# EAGLE design SpeechSynthesisBoard (EAGLE 7.5.0)
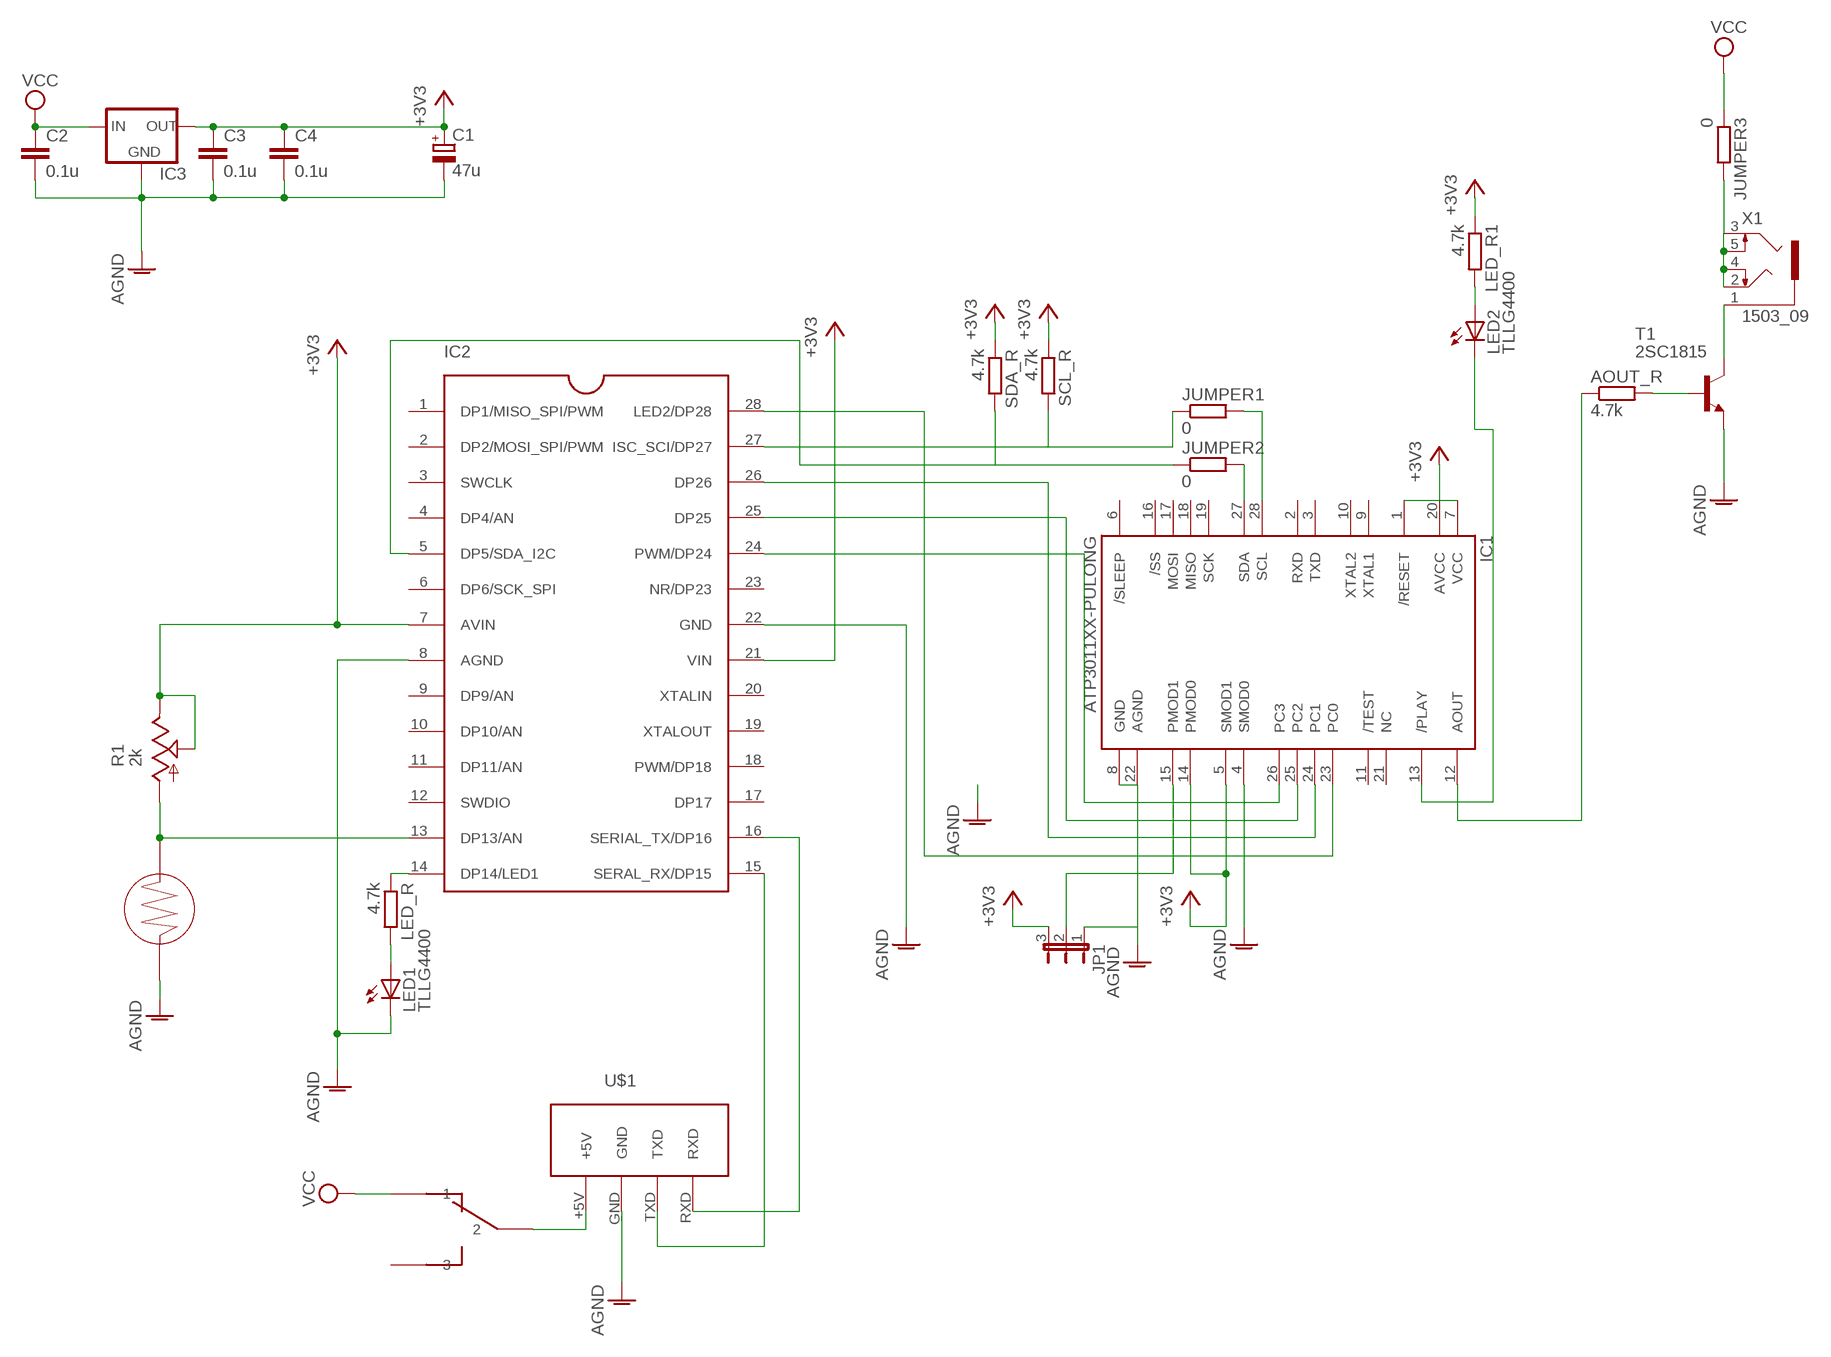
[diagram p0: schematic, sheet 1]

## Parts
AOUT_R  4.7k  R-EU_0204/7  [0204/7]
B-12JB1  B-12JV  [B-12JV]
C1  47u  CPOL-EUE2.5-5  [E2,5-5]
C2  0.1u  C-EU025-024X044  [C025-024X044]
C3  0.1u  C-EU025-024X044  [C025-024X044]
C4  0.1u  C-EU025-024X044  [C025-024X044]
CDS_5MM1  CDS_5MM  [CDS_5MM]
IC1  ATP3011XX-PULONG  [DIL28-3]
IC2  LPC1114FN28  [DIP28]
IC3  78XXL  [78XXL]
JP1  JP2E  [JP2]
JUMPER1  0  R-EU_0309/12  [0309/12]
JUMPER2  0  R-EU_0309/12  [0309/12]
JUMPER3  0  R-EU_0309/12  [0309/12]
LED1  TLLG4400  [LED3MM]
LED2  TLLG4400  [LED3MM]
LED_R  4.7k  R-EU_0204/7  [0204/7]
LED_R1  4.7k  R-EU_0204/7  [0204/7]
R1  2k  TRIM_US-CA6V  [CA6V]
SCL_R  4.7k  R-EU_0204/7  [0204/7]
SDA_R  4.7k  R-EU_0204/7  [0204/7]
T1  2SC1815  [TO92-ECB]
U$1  USB2UART  [USB2UART]
X1  1503_09  [1503_09]

## Nets
+3V3: C1.+ C3.1 C4.1 IC1.1(/RESET) IC1.5(SMOD1) IC1.7(VCC) IC1.14(PMOD0) IC1.20(AVCC) IC2.7(AVIN) IC2.21(VIN) IC3.OUT JP1.3 LED_R1.1 R1.E R1.S SCL_R.1 SDA_R.1
AGND: C1.- C2.2 C3.2 C4.2 CDS_5MM1.P$2 IC1.4(SMOD0) IC1.8(GND) IC1.22(AGND) IC2.8(AGND) IC2.22(GND) IC3.GND JP1.1 LED1.K(C) T1.E U$1.GND
N$1: LED1.A LED_R.2
N$2: IC1.13(/PLAY) LED2.K(C)
N$3: IC2.14(DP14/LED1) LED_R.1
N$4: LED2.A LED_R1.2
N$5: AOUT_R.1 IC1.12(AOUT)
N$6: AOUT_R.2 T1.B
N$7: IC2.27(ISC_SCI/DP27) JUMPER1.1 SCL_R.2
N$8: IC2.5(DP5/SDA_I2C) JUMPER2.1 SDA_R.2
N$9: T1.C X1.1
N$10: IC1.26(PC3) IC2.24(PWM/DP24)
N$11: IC1.25(PC2) IC2.25(DP25)
N$12: IC1.23(PC0) IC2.28(LED2/DP28)
N$13: IC1.24(PC1) IC2.26(DP26)
N$14: IC2.16(SERIAL_TX/DP16) U$1.RXD
N$15: IC1.15(PMOD1) JP1.2
N$16: IC2.15(SERAL_RX/DP15) U$1.TXD
N$17: B-12JB1.2 U$1.+5V
N$18: IC1.27(SDA) JUMPER2.2
N$19: CDS_5MM1.P$1 IC2.13(DP13/AN) R1.A
N$20: IC1.28(SCL) JUMPER1.2
N$21: JUMPER3.2 X1.2 X1.3 X1.4 X1.5
VCC: B-12JB1.1 C2.1 IC3.IN JUMPER3.1
Unconnected: B-12JB1.3 IC1.2(RXD) IC1.3(TXD) IC1.6(/SLEEP) IC1.9(XTAL1) IC1.10(XTAL2) IC1.11(/TEST) IC1.16(/SS) IC1.17(MOSI) IC1.18(MISO) IC1.19(SCK) IC1.21(NC) IC2.1(DP1/MISO_SPI/PWM) IC2.2(DP2/MOSI_SPI/PWM) IC2.3(SWCLK) IC2.4(DP4/AN) IC2.6(DP6/SCK_SPI) IC2.9(DP9/AN) IC2.10(DP10/AN) IC2.11(DP11/AN) IC2.12(SWDIO) IC2.17(DP17) IC2.18(PWM/DP18) IC2.19(XTALOUT) IC2.20(XTALIN) IC2.23(NR/DP23)

## Library data of the parts
AOUT_R JUMPER1-JUMPER3 LED_R LED_R1 SCL_R SDA_R = rcl:R-EU_: RESISTOR, European symbol
B-12JB1 = toggleswitchB-12JV:B-12JV
C1 = rcl:CPOL-EU: POLARIZED CAPACITOR, European symbol
C2-C4 = rcl:C-EU: CAPACITOR, European symbol
CDS_5MM1 = CdS_5mm:CDS_5MM
IC1 = aquest:ATP3011XX-PU: DIP 28 pin package
IC2 = lpc1114fn28:LPC1114FN28
IC3 = v-reg:78XXL: VOLTAGE REGULATOR
JP1 = jumper:JP2E: JUMPER
LED1 LED2 = led:TLLG4400: Low Current (2mA) LED 3 mm Tinted Diffused Package color GREEN Source: Data sheet <http://www.farnell.com/datasheets/391098.pdf>; MF: VISHAY SEMICONDUCTOR; OC_FARNELL: 1612435
R1 = pot:TRIM_US-: POTENTIOMETER
T1 = transistor:2SC1815: NPN EPITAXIAL TRANSISTOR Source: TOSHIBA .. 2SC1815 1.pdf
U$1 = USBtoUART_module(M-08461):USB2UART
X1 = con-lumberg:1503_09: Jack connectors according to JISC 6560, 3.5 mm Klinkeneinbaukupplung nach JISC 6560, 3,5 mm, 3-polig/ stereo, abgewinkelte Ausführung, mit 2 Öffnern und Lötaugen, für Leiterplatten Rückseitenmontage Source: http://www.lumberg.com/Produkte/PDFs/1503_09.pdf; OC_FARNELL: 1243244; OC_NEWARK: unknown

## Board
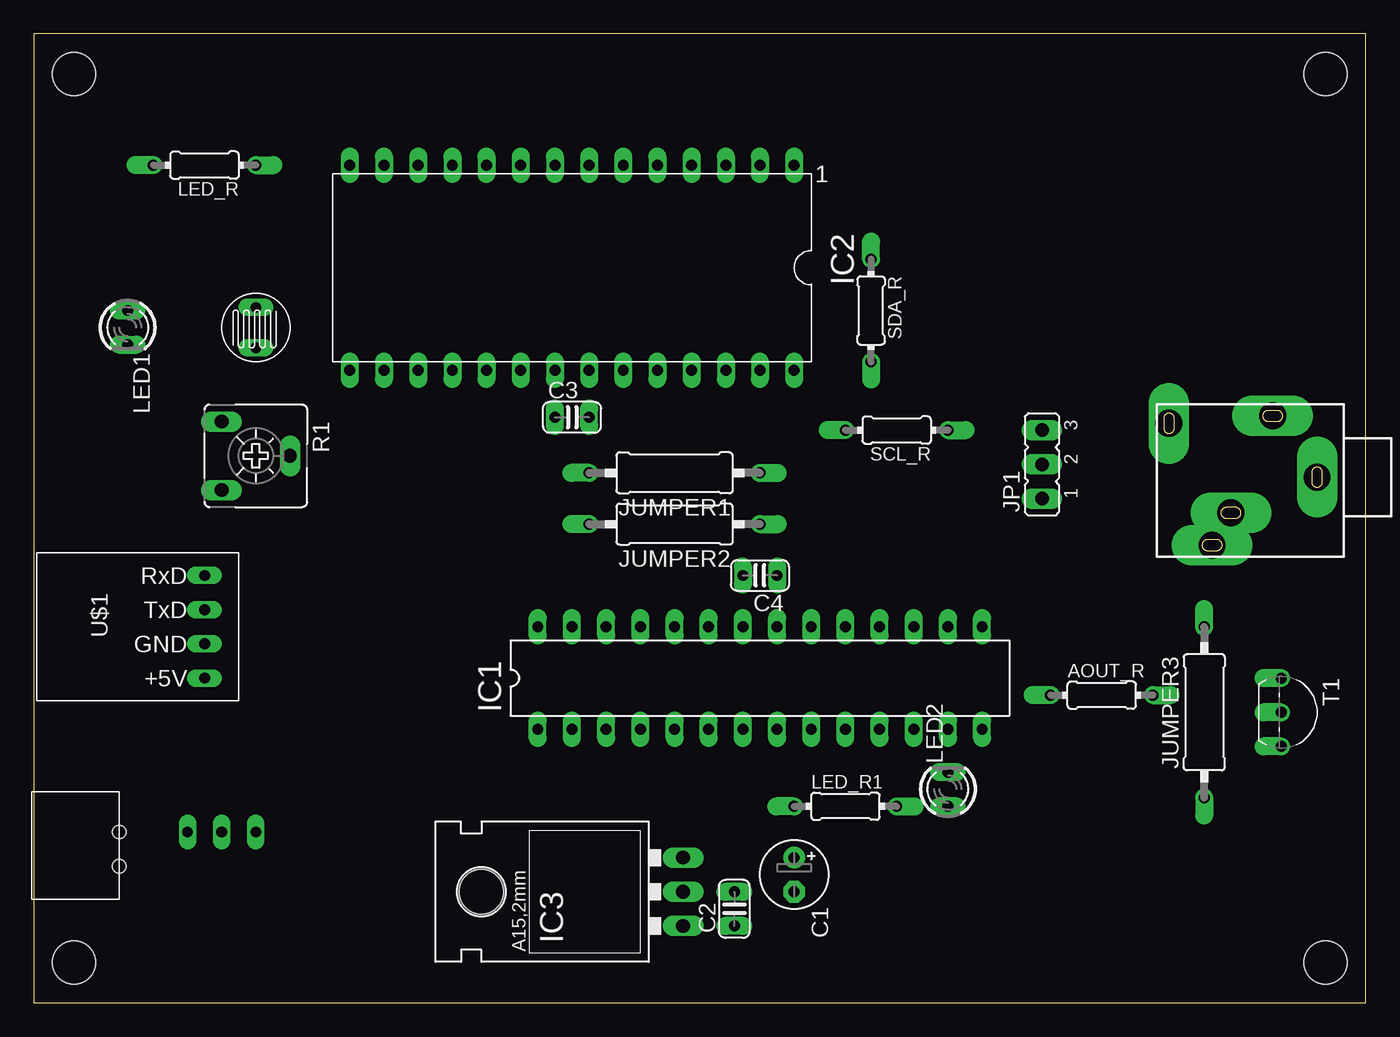
[diagram p1: board, top side]
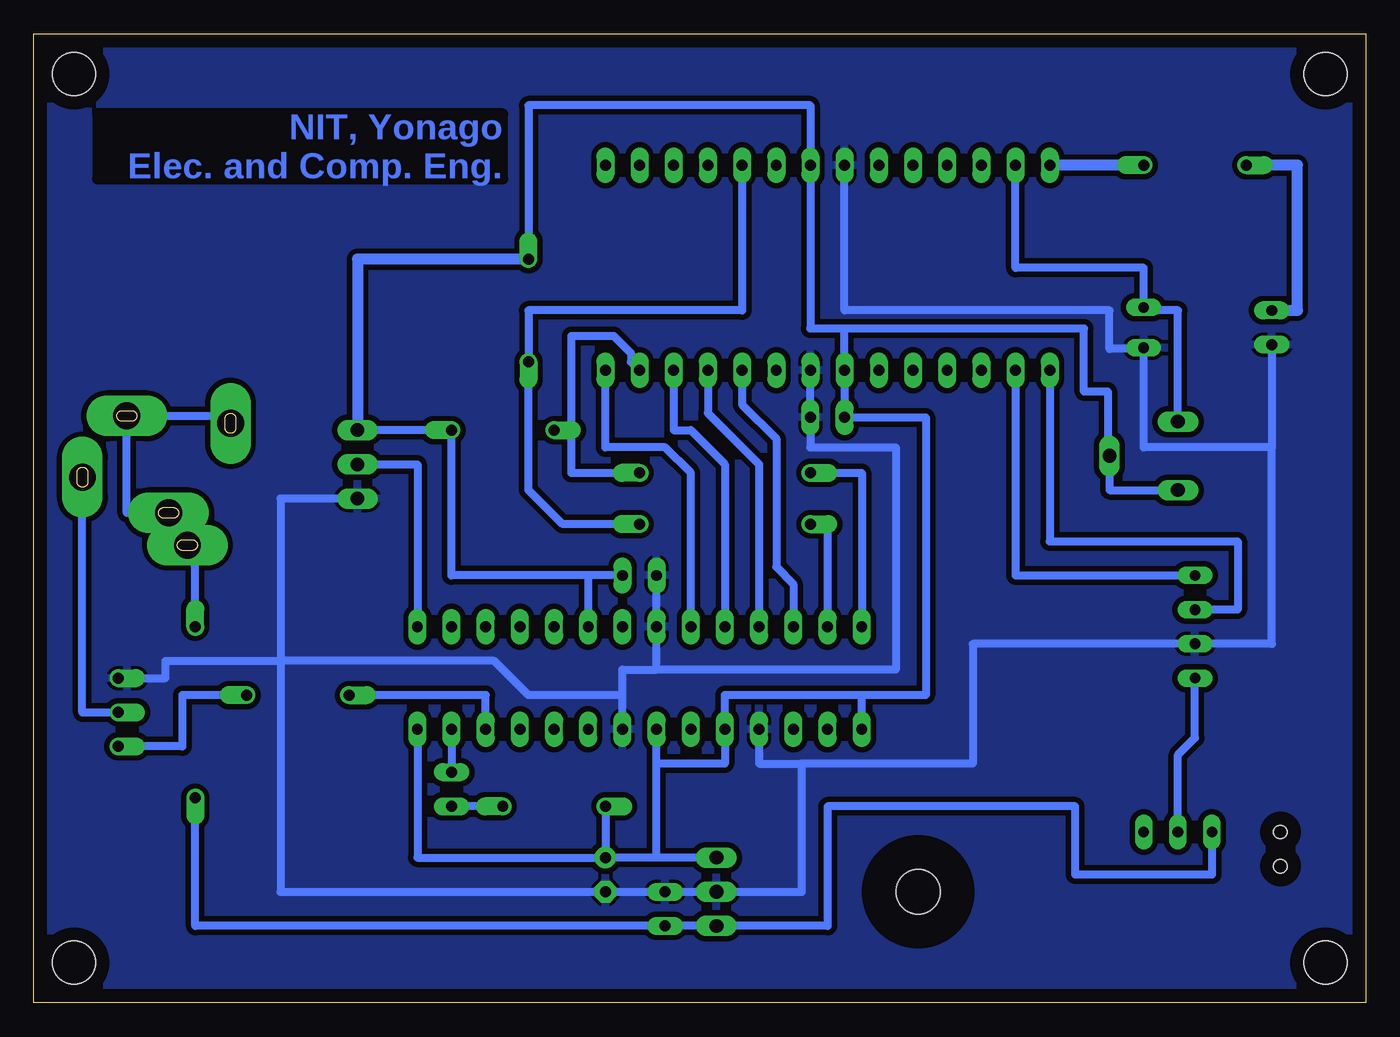
[diagram p2: board, bottom side, seen from below]

Size 99 x 72 mm. Coordinates in mm from the lower left corner, seen from the top.
Outline: 0,0 99,0 99,72 0,72 0,0
Copper layers (1*16): Top 0.035mm / dielectric 1.5mm / Bottom 0.035mm
Design rules "default *": minimum track width 24mil, minimum drill 24mil, track to track 0.4mm, track to pad 0.4mm, pad to pad 0.4mm, via to via 0.4mm, smd to smd 0.5mm, copper to edge 1mm, drill to drill 0.5mm, minimum pad ring 10mil, minimum via ring 8mil, stop-mask expansion 4mil, vias tented up to drill 0mil, thermal gap 10mil
Holes 3.2 mm at 3,3 3,69 96,69 96,3

### Footprints (pad centres in the part's own frame; a part is rotated, then mirrored left to right if it is on the bottom)
0204/7 = drill 0.813 offset: 1 -3.81,0; 2 3.81,0
B-12JV = drill 0.8 long: 1 0,5.08; 2 0,7.62; 3 0,10.16 | hole 1: 0,0; 2.54,0
E2,5-5 = drill 0.813 pad 1.6: + -1.27,0 | drill 0.813 pad 1.6 octagon: - 1.27,0
C025-024X044 = drill 0.813 long: 1 -1.27,0; 2 1.27,0
CDS_5MM = drill 0.8 long: P$1 1.5,0; P$2 -1.5,0
DIL28-3 = drill 0.813 long: 1 -16.51,-3.81; 2 -13.97,-3.81; 3 -11.43,-3.81; 4 -8.89,-3.81; 5 -6.35,-3.81; 6 -3.81,-3.81; 7 -1.27,-3.81; 8 1.27,-3.81; 9 3.81,-3.81; 10 6.35,-3.81; 11 8.89,-3.81; 12 11.43,-3.81; 13 13.97,-3.81; 14 16.51,-3.81; 15 16.51,3.81; 16 13.97,3.81; 17 11.43,3.81; 18 8.89,3.81; 19 6.35,3.81; 20 3.81,3.81; 21 1.27,3.81; 22 -1.27,3.81; 23 -3.81,3.81; 24 -6.35,3.81; 25 -8.89,3.81; 26 -11.43,3.81; 27 -13.97,3.81; 28 -16.51,3.81
DIP28 = drill 0.813 long: 1 -16.51,-7.62; 2 -13.97,-7.62; 3 -11.43,-7.62; 4 -8.89,-7.62; 5 -6.35,-7.62; 6 -3.81,-7.62; 7 -1.27,-7.62; 8 1.27,-7.62; 9 3.81,-7.62; 10 6.35,-7.62; 11 8.89,-7.62; 12 11.43,-7.62; 13 13.97,-7.62; 14 16.51,-7.62; 15 16.51,7.62; 16 13.97,7.62; 17 11.43,7.62; 18 8.89,7.62; 19 6.35,7.62; 20 3.81,7.62; 21 1.27,7.62; 22 -1.27,7.62; 23 -3.81,7.62; 24 -6.35,7.62; 25 -8.89,7.62; 26 -11.43,7.62; 27 -13.97,7.62; 28 -16.51,7.62
78XXL = drill 1.016 long: GND 0,-3.81; IN -2.54,-3.81; OUT 2.54,-3.81 | hole 3.302: 0,11.176
JP2 = drill 1 long: 1 -2.54,0; 2 0,0; 3 2.54,0
0309/12 = drill 0.813 offset: 1 -6.35,0; 2 6.35,0
LED3MM = drill 0.813 long: A -1.27,0; K 1.27,0
CA6V = drill 1.016 long: A -2.54,-2.54; E 2.54,-2.54; S 0,2.54
TO92-ECB = drill 0.813 offset: B 2.54,0; C 0,0; E -2.54,0
USB2UART = drill 0.8 long: +5V -3.81,2.54; GND -1.27,2.54; RXD 3.81,2.54; TXD 1.27,2.54
1503_09 = drill 2 pad 2.54 long: 1 0,-2.1; 2 -4.55,-5.4; 3 5.05,-9.9; 4 -4,-13.1; 5 2.65,-8.5

### Placement (x,y rotation side)
AOUT_R  79.38,22.86 0 top
B-12JB1  6.35,12.7 270 top
C1  56.52,9.53 270 top
C2  52.07,6.99 90 top
C3  40.01,43.5 0 top
C4  53.98,31.75 180 top
CDS_5MM1  16.51,50.16 90 top
IC1  53.98,24.13 0 top
IC2  40.01,54.61 180 top
IC3  44.45,8.26 90 top
JP1  74.93,40.01 90 top
JUMPER1  47.62,39.37 180 top
JUMPER2  47.62,35.56 180 top
JUMPER3  87,21.59 90 top
LED1  6.99,50.16 270 top
LED2  67.94,15.88 90 top
LED_R  12.7,62.23 180 top
LED_R1  60.33,14.61 0 top
R1  16.51,40.64 270 top
SCL_R  64.14,42.55 180 top
SDA_R  62.23,51.44 270 top
T1  92.71,21.59 270 top
U$1  15.24,27.94 90 top
X1  97.47,39.05 270 top

### Tracks (layer width: path | path; a pad name or v marks a point on that pad's centre or on a via)
+3V3
  Bottom 0.61: IC3.OUT 52.7,10.79 | 52.7,10.79 C1.+ | LED_R1.1 C1.+ | JP1.3 SCL_R.1 67.94,31.75 C4.1 57.78,31.75 IC1.20 | 70.37,20.43 IC1.14 | IC1.14 70.48,10.79 C1.+ | 52.7,10.79 52.7,17.78 | 52.7,17.78 IC1.7 | IC1.14 | R1.E 19.05,38.1 R1.S 19.18,40.89 19.18,45.4 | SDA_R.1 62.23,66.67 41.27,66.67 IC2.7 41.27,50.1 38.73,50.1 | 37.47,19.68 IC1.1 37.47,22.86 | 37.47,22.86 47.62,22.86 IC1.5 47.62,17.78 52.7,17.78 | 37.47,22.86 32.7,22.86 32.7,43.5 C3.1 IC2.21 38.73,50.1 | 38.73,50.1 20.95,50.1 20.95,45.4 19.18,45.4 | 19.18,45.43 19.18,45.4
  Bottom 0.813: SDA_R.1 74.93,55.24 JP1.3
AGND
  Bottom 0.61: 41.91,17.78 29.21,17.78 29.21,26.67 U$1.GND 6.99,26.67 6.99,41.27 | 41.91,17.78 41.91,8.26 IC3.GND C2.2 C1.- 80.64,8.26 80.64,25.4 | IC1.4 45.09,17.78 41.91,17.78 | JP1.1 80.64,37.47 80.64,25.4 | IC1.8 55.24,22.86 | 55.24,22.86 62.23,22.86 64.77,25.4 80.64,25.4 | T1.E 89.22,24.13 89.22,25.4 80.64,25.4 | 55.24,22.86 55.24,24.77 52.7,24.77 | 52.7,24.77 IC1.22 C4.2 | 52.7,24.77 34.92,24.77 34.92,41.27 41.27,41.27 C3.2 IC2.22 | CDS_5MM1.P$2 16.51,41.27 6.99,41.27 | LED1.K 6.99,41.27 | 16.51,48.9 CDS_5MM1.P$2 | CDS_5MM1.P$2 16.51,48.58 19.05,48.58 19.05,51.44 38.73,51.44 IC2.8
  pour Bottom: 0,71.75 99.06,71.75 99.06,0 0.32,0 0.32,-0.32
N$1
  Bottom 0.813: LED1.A 5.08,51.44 5.08,62.23 LED_R.2
N$2
  Bottom 0.61: IC1.13 LED2.K
N$3
  Bottom 0.813: LED_R.1 IC2.14
N$4
  Bottom 0.61: LED_R1.2 LED2.A
N$5
  Bottom 0.61: IC1.12 65.41,22.86 AOUT_R.1
N$6
  Bottom 0.61: AOUT_R.2 87.95,22.86 87.95,19.05 T1.B
N$7
  Bottom 0.61: JUMPER1.1 59.05,39.37 59.05,42.55 | IC2.27 54.61,47.62 54.61,48.26 55.88,49.53 59.05,49.53 59.05,42.55 | SCL_R.2 59.05,42.55
N$8
  Bottom 0.61: JUMPER2.1 59.69,35.56 62.23,38.1 SDA_R.2 62.23,51.44 46.35,51.44 IC2.5
N$9
  Bottom 0.61: T1.C 95.37,21.59 X1.1
N$10
  Bottom 0.61: IC1.26 42.55,31.11 43.81,32.38 43.81,41.91 46.35,44.45 IC2.24
N$11
  Bottom 0.61: IC2.25 48.9,43.81 45.09,40.01 IC1.25
N$12
  Bottom 0.61: IC1.23 50.16,39.37 52.07,41.27 56.52,41.27 IC2.28
N$13
  Bottom 0.61: IC2.26 51.44,42.55 50.16,42.55 47.62,40.01 IC1.24
N$14
  Bottom 0.61: IC2.16 26.04,31.75 U$1.RXD
N$15
  Bottom 0.61: JP1.2 70.48,40.01 IC1.15
N$16
  Bottom 0.61: U$1.TXD 9.53,29.21 9.53,34.29 23.5,34.29 IC2.15
N$17
  Bottom 0.61: B-12JB1.2 13.97,18.41 12.7,19.68 U$1.+5V
N$18
  Bottom 0.61: IC1.27 40.01,35.56 JUMPER2.2
N$19
  Bottom 0.61: IC2.13 26.04,54.61 16.51,54.61 CDS_5MM1.P$1 16.51,51.44 13.97,51.44 R1.A
N$20
  Bottom 0.61: IC1.28 37.47,39.37 JUMPER1.2
N$21
  Bottom 0.61: JUMPER3.2 87,33.97 87.57,33.97 X1.3 88.97,34 X1.5 92.07,36.4 X1.2 84.37,43.6 X1.4
VCC
  Bottom 0.61: B-12JB1.1 11.43,9.53 21.59,9.53 21.59,14.61 40.01,14.61 40.01,5.71 IC3.IN C2.1 87,5.71 JUMPER3.1

### Text on the board
Bottom: NIT, Yonago / Elec. and Comp. Eng.